# EAGLE design IR 1E1R (EAGLE 8.6.0)
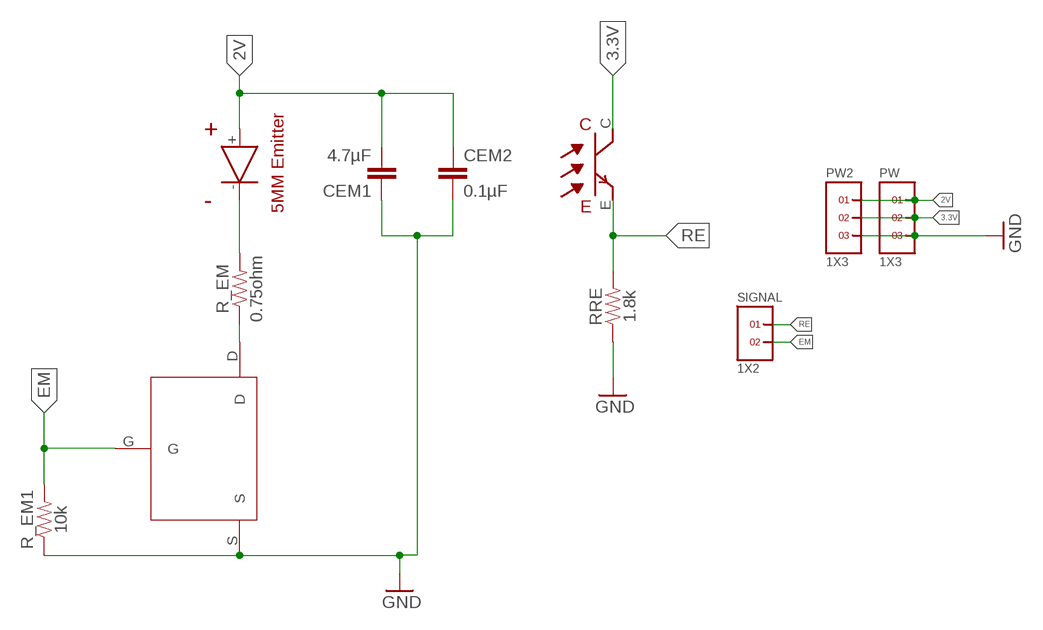
[diagram p0: schematic, sheet 1]

## Parts
CEM1  4.7µF  0.33UF/330NF-0805-50V-10%  [0805]
CEM2  0.1µF  0.33UF/330NF-0805-50V-10%  [0805]
PW  1X3  [1X3]
PW2  1X3  [1X3]
R_EM  0.75ohm  0.75OHM-0805-1/4W-1%  [0805]
R_EM1  10k  0.75OHM-0805-1/4W-1%  [0805]
RECEIVER  RECEIVER  [RECEIVER]
RRE  1.8k  0.75OHM-0805-1/4W-1%  [0805]
SIGNAL  1X2  [1X2]
U$1  MCH3474  [MCH3474]
U$21  EMITTER  [EMITTER]

## Nets
2V: CEM1.2 CEM2.1 PW2.1 PW.1 U$21.+
3.3V: PW2.2 PW.2 RECEIVER.C
EM: R_EM1.2 SIGNAL.2 U$1.G
EM-: R_EM.2 U$21.-
GND: CEM1.1 CEM2.2 PW2.3 PW.3 R_EM1.1 RRE.1 U$1.S
N$1: R_EM.1 U$1.D
RE: RECEIVER.E RRE.2 SIGNAL.1

## Library data of the parts
CEM1 CEM2 = SparkFun-Capacitors:0.33UF/330NF: 0.33µF/330nF ceramic capacitors A capacitor is a passive two-terminal electrical component used to store electrical energy temporarily in an electric field.; PROD_ID: CAP-08469; VALUE: 0.33µF
PW PW2 = headers(2mm):1X3
R_EM R_EM1 RRE = SparkFun-Resistors:0.75OHM: 0.75Ω resistor A resistor is a passive two-terminal electrical component that implements electrical resistance as a circuit element. Resistors act to reduce current flow, and, at the same time, act to lower voltage levels within circuits. - Wikipedia; PROD_ID: RES-08474; VALUE: 0.75
RECEIVER = sfh4550 & teft4300:RECEIVER
SIGNAL = headers(2mm):1X2
U$1 = MCH3474:MCH3474
U$21 = sfh4550 & teft4300:EMITTER

## Board
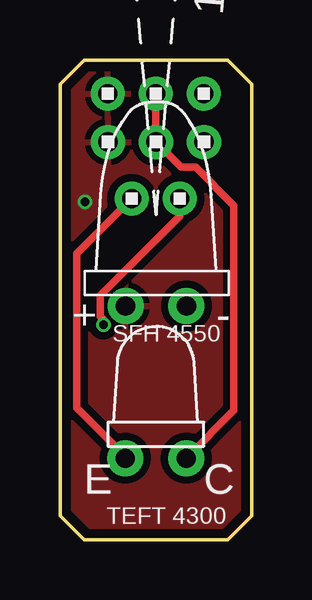
[diagram p1: board, top side]
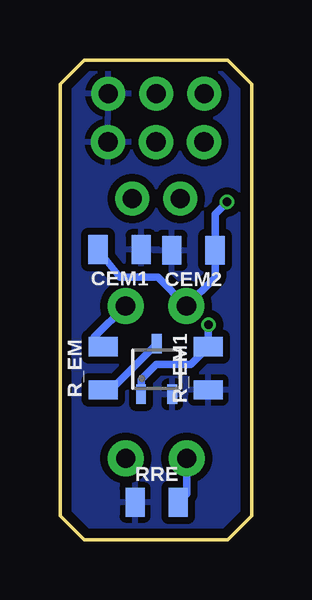
[diagram p2: board, bottom side, seen from below]

Size 8 x 20 mm. Coordinates in mm from the lower left corner, seen from the top.
Outline: 1,0 7,0 8,1 8,19 7,20 1,20 0,19 0,1 1,0
Copper layers (1*16): Top 0.035559375mm / dielectric 1.6mm / Bottom 0.035559375mm
Design rules "oshpark-2layer *": minimum track width 6mil, minimum drill 10mil, track to track 6mil, track to pad 6mil, pad to pad 6mil, via to via 6mil, smd to smd 6mil, copper to edge 15mil, drill to drill 6mil, minimum pad ring 5mil, minimum via ring 5mil, stop-mask expansion 2.5mil, vias tented up to drill 12mil, thermal gap 10mil

### Footprints (pad centres in the part's own frame; a part is rotated, then mirrored left to right if it is on the bottom)
0805 = smd 0.8 x 1.2: 1 -0.9,0; 2 0.9,0
1X3 = drill 0.8 pad 1.422: 1 -2,0; 2 0,0; 3 2,0
RECEIVER = drill 0.8 pad 1.5: C 1.27,-0.5; E -1.27,-0.5
1X2 = drill 0.8 pad 1.422: 1 -1,0; 2 1,0
MCH3474 = smd 0.406 x 0.813: D 0,1.05; G -0.65,-1.05; S 0.65,-1.05
EMITTER = drill 0.8 pad 1.5: + -1.27,-0.5; - 1.27,-0.5

### Placement (x,y rotation side)
CEM1  5.52,12.09 180 bottom
CEM2  2.44,12.06 180 bottom
PW  4,16.58 0 top
PW2  3.99,18.59 0 top
R_EM  6.2,7.14 90 bottom
R_EM1  1.82,7.14 90 bottom
RECEIVER  3.99,3.89 0 top
RRE  3.97,1.55 0 bottom
SIGNAL  3.99,14.22 0 top
U$1  3.97,7.11 0 bottom
U$21  4,10.24 0 top

### Tracks (layer width: path | path; a pad name or v marks a point on that pad's centre or on a via)
2V  (via drill 0.35)
  Bottom 0.305: CEM1.2 5.51,10.94 3.93,10.94 U$21.+ 1.54,10.93 CEM2.1 1.54,13.58 v1.04,14.08
  pour Top (isolate 0.305): -6.5,23 -6.5,-9 -3.5,-12 13.5,-12 14.5,-11 14.5,22 11.5,25 -4.5,25
3.3V
  Top 0.305: PW2.2 PW.2 5.05,15.53 5.65,15.53 7.25,13.93 7.25,5.38 RECEIVER.C
EM  (via drill 0.35)
  Top 0.305: v1.81,8.96 1.81,9.17 1.67,9.3 1.67,10.18 4.99,13.49 SIGNAL.2
  Bottom 0.305: U$1.G 4.62,6.67 3.99,7.3 2.56,7.3 R_EM1.2 1.82,8.95 v1.81,8.96
EM-
  Bottom 0.305: R_EM.2 6.57,8.44 U$21.-
GND
  pour Bottom (isolate 0.305): -3.45,31 -3.45,0 11.5,-11 11.5,20
N$1
  Bottom 0.305: U$1.D 5.82,6.31 R_EM.1
RE
  Top 0.305: SIGNAL.1 0.7,11.93 0.7,5.49 2.72,3.47 RECEIVER.E
  Bottom 0.305: RRE.2 2.72,1.9 RECEIVER.E